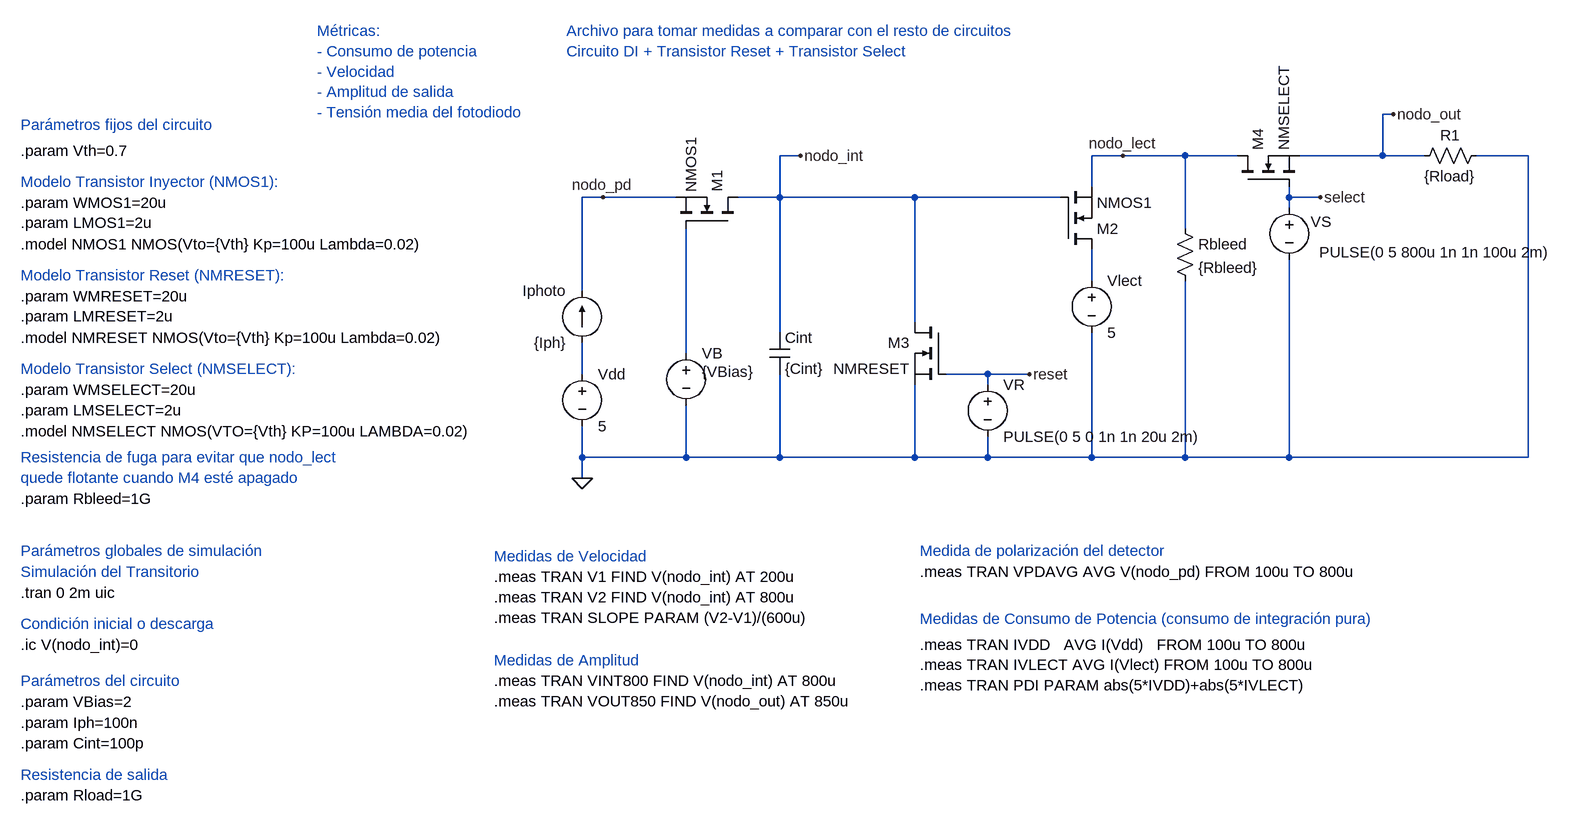
[diagram p0: schematic ID_Comp.asc]
ID_Comp.asc, the LTspice schematic file:
Version 4.1
SHEET 1 1592 1016
WIRE 816 -64 800 -64
WIRE -96 0 -128 0
WIRE 400 0 352 0
WIRE 496 0 400 0
WIRE 576 0 496 0
WIRE 800 0 800 -64
WIRE 800 0 672 0
WIRE 864 0 800 0
WIRE 1024 0 944 0
WIRE 352 48 352 0
WIRE -400 64 -432 64
WIRE -288 64 -400 64
WIRE -128 64 -128 0
WIRE -128 64 -192 64
WIRE 80 64 -128 64
WIRE 304 64 80 64
WIRE 656 64 656 48
WIRE 704 64 656 64
WIRE 656 80 656 64
WIRE 496 112 496 0
WIRE 352 192 352 144
WIRE -432 208 -432 64
WIRE 80 256 80 64
WIRE -128 272 -128 64
WIRE -272 304 -272 112
WIRE -432 336 -432 288
WIRE 192 336 128 336
WIRE 256 336 192 336
WIRE 192 352 192 336
WIRE -432 464 -432 416
WIRE -272 464 -272 384
WIRE -272 464 -432 464
WIRE -128 464 -128 336
WIRE -128 464 -272 464
WIRE 80 464 80 352
WIRE 80 464 -128 464
WIRE 192 464 192 432
WIRE 192 464 80 464
WIRE 352 464 352 272
WIRE 352 464 192 464
WIRE 496 464 496 192
WIRE 496 464 352 464
WIRE 656 464 656 160
WIRE 656 464 496 464
WIRE 1024 464 1024 0
WIRE 1024 464 656 464
WIRE -432 496 -432 464
FLAG -96 0 nodo_int
FLAG -432 496 0
FLAG 256 336 reset
FLAG 816 -64 nodo_out
FLAG 704 64 select
FLAG 400 0 nodo_lect
FLAG -400 64 nodo_pd
SYMBOL current -432 288 R180
WINDOW 0 24 80 Left 2
WINDOW 3 24 0 Left 2
SYMATTR InstName Iphoto
SYMATTR Value {Iph}
SYMBOL nmos -192 112 M270
SYMATTR InstName M1
SYMATTR Value NMOS1
SYMATTR SpiceLine W={WMOS1} L={LMOS1}
SYMBOL cap -144 272 R0
SYMATTR InstName Cint
SYMATTR Value {Cint}
SYMBOL voltage -272 288 R0
WINDOW 3 24 44 Left 2
SYMATTR Value {VBias}
SYMATTR InstName VB
SYMBOL voltage -432 320 R0
WINDOW 123 0 0 Left 0
WINDOW 39 0 0 Left 0
SYMATTR InstName Vdd
SYMATTR Value 5
SYMBOL voltage 192 336 R0
WINDOW 123 0 0 Left 0
WINDOW 39 0 0 Left 0
SYMATTR InstName VR
SYMATTR Value PULSE(0 5 0 1n 1n 20u 2m)
SYMBOL nmos 128 256 M0
SYMATTR InstName M3
SYMATTR Value NMRESET
SYMATTR SpiceLine W={WMRESET} L={LMRESET}
SYMBOL nmos 576 48 R270
SYMATTR InstName M4
SYMATTR Value NMSELECT
SYMATTR SpiceLine W={WMSELECT} L={LMSELECT}
SYMBOL voltage 656 64 R0
WINDOW 0 49 22 Top 2
WINDOW 3 225 100 Bottom 2
WINDOW 123 0 0 Left 0
WINDOW 39 0 0 Left 0
SYMATTR InstName VS
SYMATTR Value PULSE(0 5 800u 1n 1n 100u 2m)
SYMBOL res 848 16 R270
WINDOW 0 32 56 VTop 2
WINDOW 3 0 56 VBottom 2
SYMATTR InstName R1
SYMATTR Value {Rload}
SYMBOL nmos 304 144 M180
SYMATTR InstName M2
SYMATTR Value NMOS1
SYMBOL voltage 352 176 R0
SYMATTR InstName Vlect
SYMATTR Value 5
SYMBOL res 480 96 R0
SYMATTR InstName Rbleed
SYMATTR Value {Rbleed}
TEXT -456 -192 Left 2 ;Archivo para tomar medidas a comparar con el resto de circuitos\nCircuito DI + Transistor Reset + Transistor Select
TEXT -1296 136 Left 2 !.model NMOS1 NMOS(Vto={Vth} Kp=100u Lambda=0.02)
TEXT -1296 72 Left 2 !.param WMOS1=20u\n.param LMOS1=2u
TEXT -1296 40 Left 2 ;Modelo Transistor Inyector (NMOS1):
TEXT -1296 640 Left 2 ;Simulación del Transitorio
TEXT -1296 752 Left 2 !.ic V(nodo_int)=0
TEXT -1296 720 Left 2 ;Condición inicial o descarga
TEXT -1296 840 Left 2 !.param VBias=2
TEXT -1296 872 Left 2 !.param Iph=100n
TEXT -1296 -8 Left 2 !.param Vth=0.7
TEXT -1296 808 Left 2 ;Parámetros del circuito
TEXT -1296 904 Left 2 !.param Cint=100p
TEXT -1296 672 Left 2 !.tran 0 2m uic
TEXT -1296 184 Left 2 ;Modelo Transistor Reset (NMRESET):
TEXT -1296 216 Left 2 !.param WMRESET=20u\n.param LMRESET=2u
TEXT -1296 280 Left 2 !.model NMRESET NMOS(Vto={Vth} Kp=100u Lambda=0.02)
TEXT -1296 424 Left 2 !.model NMSELECT NMOS(VTO={Vth} KP=100u LAMBDA=0.02)
TEXT -1296 328 Left 2 ;Modelo Transistor Select (NMSELECT):
TEXT -1296 360 Left 2 !.param WMSELECT=20u\n.param LMSELECT=2u
TEXT -1296 984 Left 2 !.param Rload=1G
TEXT -1296 464 Left 2 ;Resistencia de fuga para evitar que nodo_lect \nquede flotante cuando M4 esté apagado
TEXT -1296 528 Left 2 !.param Rbleed=1G
TEXT -840 -192 Left 2 ;Métricas:\n- Consumo de potencia\n- Velocidad\n- Amplitud de salida\n- Tensión media del fotodiodo
TEXT -568 616 Left 2 ;Medidas de Velocidad
TEXT -568 648 Left 2 !.meas TRAN V1 FIND V(nodo_int) AT 200u\n.meas TRAN V2 FIND V(nodo_int) AT 800u\n.meas TRAN SLOPE PARAM (V2-V1)/(600u)
TEXT -1296 -48 Left 2 ;Parámetros fijos del circuito
TEXT -1296 608 Left 2 ;Parámetros globales de simulación
TEXT -1296 952 Left 2 ;Resistencia de salida
TEXT -568 776 Left 2 ;Medidas de Amplitud
TEXT -568 808 Left 2 !.meas TRAN VINT800 FIND V(nodo_int) AT 800u\n.meas TRAN VOUT850 FIND V(nodo_out) AT 850u
TEXT 88 608 Left 2 ;Medida de polarización del detector
TEXT 88 640 Left 2 !.meas TRAN VPDAVG AVG V(nodo_pd) FROM 100u TO 800u
TEXT 88 712 Left 2 ;Medidas de Consumo de Potencia (consumo de integración pura)
TEXT 88 752 Left 2 !.meas TRAN IVDD   AVG I(Vdd)   FROM 100u TO 800u\n.meas TRAN IVLECT AVG I(Vlect) FROM 100u TO 800u\n.meas TRAN PDI PARAM abs(5*IVDD)+abs(5*IVLECT)

The netlist it stands for:
* ID_Comp.asc
Iphoto N003 nodo_pd {Iph}
M1 nodo_int N002 nodo_pd nodo_pd NMOS1 W={WMOS1} L={LMOS1}
Cint nodo_int 0 {Cint}
VB N002 0 {VBias}
Vdd N003 0 5
VR reset 0 PULSE(0 5 0 1n 1n 20u 2m)
M3 nodo_int reset 0 0 NMRESET W={WMRESET} L={LMRESET}
M4 nodo_lect select nodo_out nodo_out NMSELECT W={WMSELECT} L={LMSELECT}
VS select 0 PULSE(0 5 800u 1n 1n 100u 2m)
R1 nodo_out 0 {Rload}
M2 N001 nodo_int nodo_lect nodo_lect NMOS1
Vlect N001 0 5
Rbleed nodo_lect 0 {Rbleed}
.model NMOS NMOS
.model PMOS PMOS
.lib standard.mos
* Archivo para tomar medidas a comparar con el resto de circuitos
* Circuito DI + Transistor Reset + Transistor Select
.model NMOS1 NMOS(Vto={Vth} Kp=100u Lambda=0.02)
.param WMOS1=20u
.param LMOS1=2u
* Modelo Transistor Inyector (NMOS1):
* Simulación del Transitorio
.ic V(nodo_int)=0
* Condición inicial o descarga
.param VBias=2
.param Iph=100n
.param Vth=0.7
* Parámetros del circuito
.param Cint=100p
.tran 0 2m uic
* Modelo Transistor Reset (NMRESET):
.param WMRESET=20u
.param LMRESET=2u
.model NMRESET NMOS(Vto={Vth} Kp=100u Lambda=0.02)
.model NMSELECT NMOS(VTO={Vth} KP=100u LAMBDA=0.02)
* Modelo Transistor Select (NMSELECT):
.param WMSELECT=20u
.param LMSELECT=2u
.param Rload=1G
* Resistencia de fuga para evitar que nodo_lect
* quede flotante cuando M4 esté apagado
.param Rbleed=1G
* Métricas:
* - Consumo de potencia
* - Velocidad
* - Amplitud de salida
* - Tensión media del fotodiodo
* Medidas de Velocidad
.meas TRAN V1 FIND V(nodo_int) AT 200u
.meas TRAN V2 FIND V(nodo_int) AT 800u
.meas TRAN SLOPE PARAM (V2-V1)/(600u)
* Parámetros fijos del circuito
* Parámetros globales de simulación
* Resistencia de salida
* Medidas de Amplitud
.meas TRAN VINT800 FIND V(nodo_int) AT 800u
.meas TRAN VOUT850 FIND V(nodo_out) AT 850u
* Medida de polarización del detector
.meas TRAN VPDAVG AVG V(nodo_pd) FROM 100u TO 800u
* Medidas de Consumo de Potencia (consumo de integración pura)
.meas TRAN IVDD   AVG I(Vdd)   FROM 100u TO 800u
.meas TRAN IVLECT AVG I(Vlect) FROM 100u TO 800u
.meas TRAN PDI PARAM abs(5*IVDD)+abs(5*IVLECT)
.backanno
.end

* Results of the author's LTspice run, read from the files saved beside the schematic
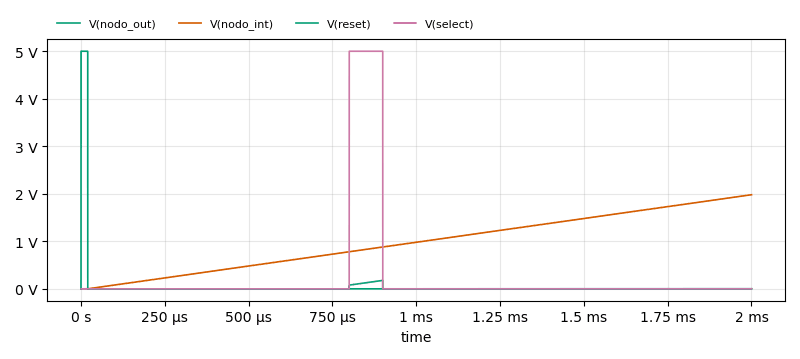
[diagram p1: Transient Analysis of ID_Comp.asc, plotted from the saved traces]
* Transient Analysis, 1 run:
*   V(nodo_out): min 0 V, max 177.5 mV, average 7.211 mV, rms 29.33 mV, last 2.555 mV
*   V(nodo_int): min 0 V, max 1.98 V, average 980.1 mV, rms 1.137 V, last 1.98 V
*   V(reset): min 0 V, max 5 V, average 50 mV, rms 500 mV, last 0 V
*   V(select): min 0 V, max 5 V, average 250 mV, rms 1.118 V, last 0 V
* From the log:
*   v1: V(nodo_int) =0.180021421643 at 0.0002
*   v2: V(nodo_int) =0.780015587807 at 0.0008
*   slope: (V2-V1)/(600u)=999.99027694
*   vint800: V(nodo_int) =0.780015587807 at 0.0008
*   vout850: V(nodo_out) =0.127897252648 at 0.00085
*   vpdavg: AVG(V(nodo_pd) )=0.43014129663 FROM 0.0001 TO 0.0008
*   ivdd: AVG(I(Vdd)   )=-1.00000001169e-07 FROM 0.0001 TO 0.0008
*   ivlect: AVG(I(Vlect) )=-1.3428300953e-11 FROM 0.0001 TO 0.0008
*   pdi: abs(5*IVDD)+abs(5*IVLECT)=5.00067147348e-07